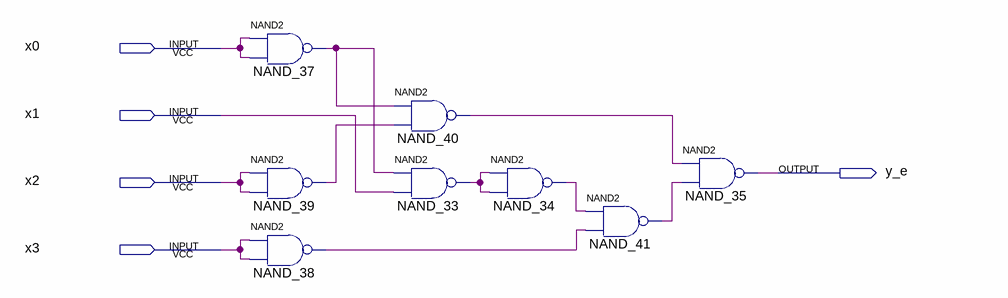
[diagram p0: schematic sheet]
// Quartus schematic e_schema.bdf as structural Verilog: 8 symbols, 5 pins
module e_schema (
  input  x0,
  input  x1,
  input  x2,
  input  x3,
  output y_e
);

  wire NAND_33_out, NAND_34_out, NAND_37_out, NAND_38_out, NAND_39_out, NAND_40_out, NAND_41_out;

  nand NAND_37 (NAND_37_out, x0, x0);
  nand NAND_39 (NAND_39_out, x2, x2);
  nand NAND_38 (NAND_38_out, x3, x3);
  nand NAND_40 (NAND_40_out, NAND_37_out, NAND_39_out);
  nand NAND_33 (NAND_33_out, NAND_37_out, x1);
  nand NAND_34 (NAND_34_out, NAND_33_out, NAND_33_out);
  nand NAND_41 (NAND_41_out, NAND_34_out, NAND_38_out);
  nand NAND_35 (y_e, NAND_40_out, NAND_41_out);
endmodule
